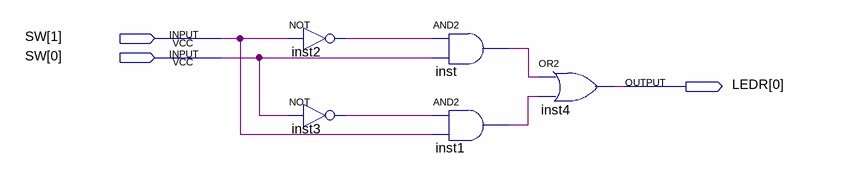
[diagram p0: schematic sheet]
// Quartus schematic exemplo01.bdf as structural Verilog: 5 symbols, 3 pins
module exemplo01 (
  input  [1:0] SW,
  output [0:0] LEDR
);

  wire inst1_out, inst2_out, inst3_out, inst_out;

  not inst2 (inst2_out, SW[1]);
  not inst3 (inst3_out, SW[0]);
  and inst (inst_out, inst2_out, SW[0]);
  and inst1 (inst1_out, inst3_out, SW[1]);
  or inst4 (LEDR[0], inst_out, inst1_out);
endmodule
